# EAGLE design midi_IO_Thru (EAGLE 9.3.0)
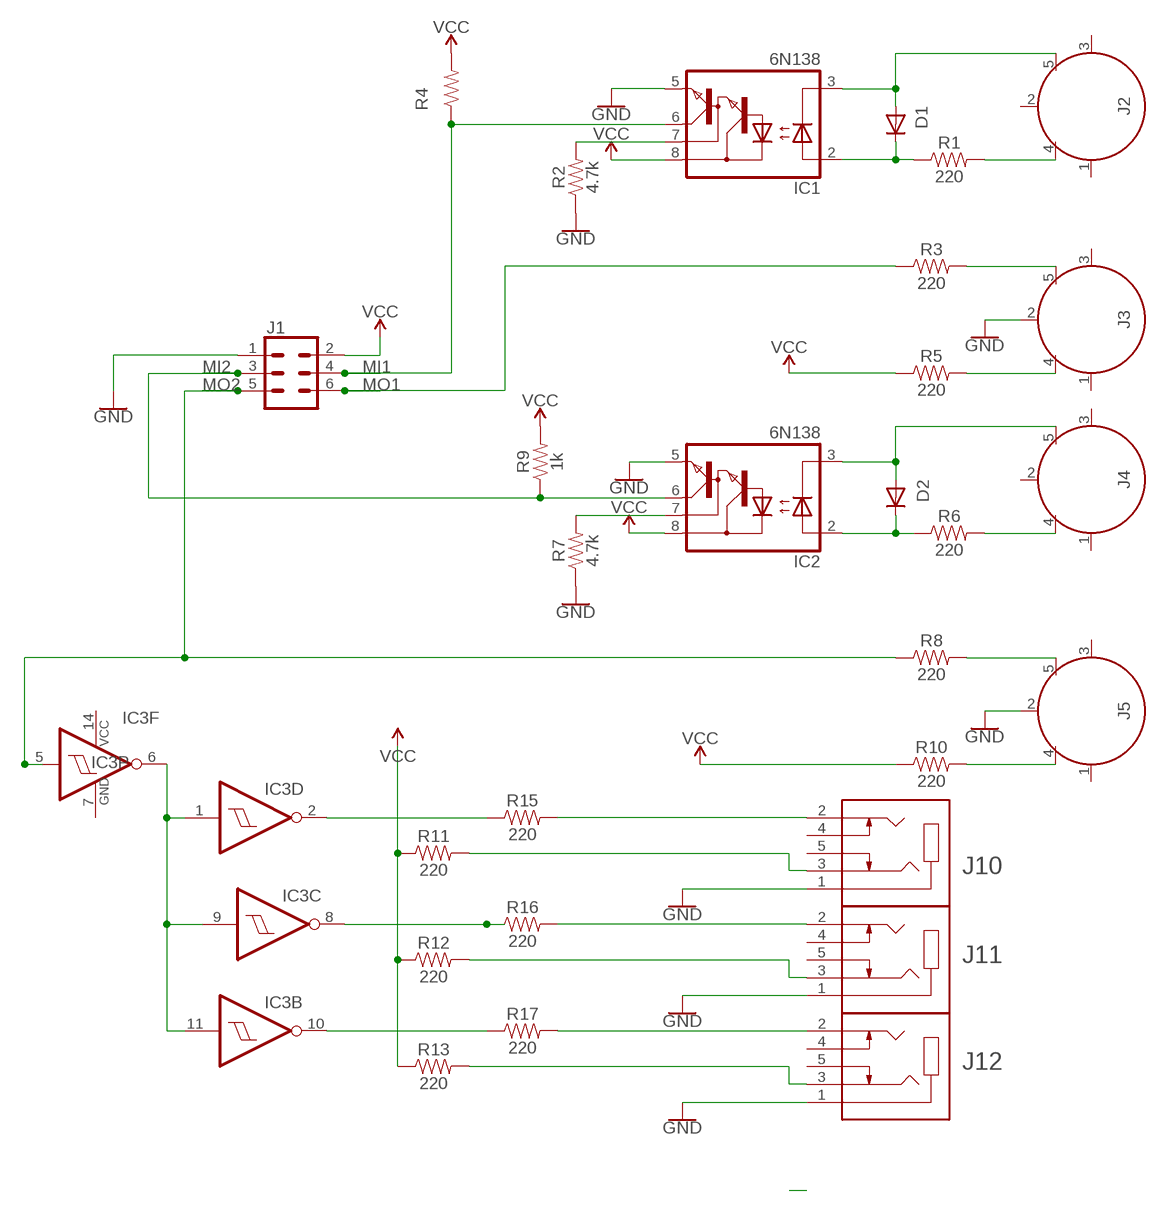
[diagram p0: schematic, sheet 1]

## Parts
D1  1N4148DO35-7  [DO35-7]
D2  1N4148DO35-7  [DO35-7]
IC1  6N138  [DIL08]
IC2  6N138  [DIL08]
IC3  74HC14D  [SO14]
J1  CONN_03X2SHROUD  [2X3-SHROUDED]
J2  DIN5  [DIN5-RA-PTH]
J3  DIN5  [DIN5-RA-PTH]
J4  DIN5  [DIN5-RA-PTH]
J5  DIN5  [DIN5-RA-PTH]
J10  SJ1-3535NG  [CUI_SJ1-3535NG]
J11  SJ1-3535NG  [CUI_SJ1-3535NG]
J12  SJ1-3535NG  [CUI_SJ1-3535NG]
R1  220  330OHM-HORIZ-1/10W-5%  [AXIAL-0.3]
R2  4.7k  330OHM-HORIZ-1/10W-5%  [AXIAL-0.3]
R3  220  330OHM-HORIZ-1/10W-5%  [AXIAL-0.3]
R4  1k  330OHM-HORIZ-1/10W-5%  [AXIAL-0.3]
R5  220  330OHM-HORIZ-1/10W-5%  [AXIAL-0.3]
R6  220  330OHM-HORIZ-1/10W-5%  [AXIAL-0.3]
R7  4.7k  330OHM-HORIZ-1/10W-5%  [AXIAL-0.3]
R8  220  330OHM-HORIZ-1/10W-5%  [AXIAL-0.3]
R9  1k  330OHM-HORIZ-1/10W-5%  [AXIAL-0.3]
R10  220  330OHM-HORIZ-1/10W-5%  [AXIAL-0.3]
R11  220  330OHM-HORIZ-1/10W-5%  [AXIAL-0.3]
R12  220  330OHM-HORIZ-1/10W-5%  [AXIAL-0.3]
R13  220  330OHM-HORIZ-1/10W-5%  [AXIAL-0.3]
R15  220  330OHM-HORIZ-1/10W-5%  [AXIAL-0.3]
R16  220  330OHM-HORIZ-1/10W-5%  [AXIAL-0.3]
R17  220  330OHM-HORIZ-1/10W-5%  [AXIAL-0.3]

## Nets
GND: IC1.5(GND) IC2.5(GND) J1.1 J3.2 J5.2 J10.1 J11.1 J12.1 R2.P$1 R7.P$1
MI1: IC1.6(VO) J1.4 R4.P$1
MI2: IC2.6(VO) J1.3 R9.P$1
MO1: J1.6 R3.P$1
MO2: IC3.5(F:I) J1.5 R8.P$1
N$1: IC3.1(D:I) IC3.6(F:O) IC3.9(C:I) IC3.11(B:I)
N$2: IC3.2(D:O) R15.P$1
N$3: IC3.8(C:O) R16.P$1
N$4: IC3.10(B:O) R17.P$1
N$5: J10.2 R15.P$2
N$6: J11.2 R16.P$2
N$7: J12.2 R17.P$2
N$8: D1.C IC1.2(A) R1.P$1
N$9: J10.3 R11.P$2
N$10: J11.3 R12.P$2
N$11: J12.3 R13.P$2
N$13: J5.4 R10.P$2
N$14: D2.A IC2.3(C) J4.5
N$15: D2.C IC2.2(A) R6.P$1
N$16: J4.4 R6.P$2
N$17: J2.4 R1.P$2
N$18: IC1.7(VB) R2.P$2
N$19: J3.5 R3.P$2
N$20: J3.4 R5.P$2
N$21: J5.5 R8.P$2
N$23: IC2.7(VB) R7.P$2
N$26: D1.A IC1.3(C) J2.5
VCC: IC1.8(VCC) IC2.8(VCC) J1.2 R4.P$2 R5.P$1 R9.P$2 R10.P$1 R11.P$1 R12.P$1 R13.P$1
Unconnected: IC3.3(E:I) IC3.4(E:O) IC3.12(A:O) IC3.13(A:I) J2.1 J2.2 J2.3 J3.1 J3.3 J4.1 J4.2 J4.3 J5.1 J5.3 J10.4 J10.5 J11.4 J11.5 J12.4 J12.5

## Power pins joined to a net without a drawn wire
GND: IC3.7(P:GND)
VCC: IC3.14(P:VCC)

## Library data of the parts
D1 D2 = diode:1N4148: DIODE high speed (Philips)
IC1 IC2 = optocoupler:6N138: MOTOROLA OPTO COUPLER; MF: VISHAY/TELEFUNKEN; MPN: 6N138; OC_FARNELL: 9860150; OC_NEWARK: 35K5294
IC3 = 74xx-eu:74*14: Hex schmitt trigger INVERTER
J1 = SparkFun-Connectors:CONN_03X2: Multi connection point. Often used as Generic Header-pin footprint for 0.1 inch spaced/style header connections You can populate with any combo of single row headers, but if you'd like an exact match, check these: Header - 2x3 (Male, 0.1") <https://www.sparkfun.com/products/12807> (PRT-12807) Header - 2x3 (Female, 0.1") <https://www.sparkfun.com/products/13010> (PRT-13010) 2x3 Pin Shrouded Header <https://www.sparkfun.com/products/10877> (PRT-10877) On any of the 0.1 inch spaced packages, you can populate with these: Break Away Headers - Straight <https://www.sparkfun.com/products/116> (PRT-00116) Break Away Male Headers - Right Angle <https://www.sparkfun.com/products/553> (PRT-00553) Female Headers <https://www.sparkfun.com/products/115> (PRT-00115) Break Away Headers - Machine Pin <https://www.sparkfun.com/products/117> (PRT-00117) Break Away Female Headers - Swiss Machine Pin <https://www.sparkfun.com/products/743> (PRT-00743) Special note: the shrouded connector mates well with our 3x2 ribbon cables: Ribbon Crimp Connector - 6-pin (2x3, Female) <https://www.sparkfun.com/products/10651> (PRT-10651) Ribbon Cable - 6 wire (15ft) <https://www.sparkfun.com/products/10646> (PRT-10646); PROD_ID: CONN-10681; SF_ID: PRT_10877
J2-J5 = SparkFun-Connectors:DIN5: DIN5 Connector - Female Right Angle (frequently used as a MIDI Jack connector) This type of connector and cable is frequently used for transmitting midi data (musical instrument digital interface). It is what you usually see on a keyboard or set of electronic drums. Learn more here <https://en.wikipedia.org/wiki/MIDI>. For more information on the pinout and electrical specifications of MIDI communications, please see the following resource: https://www.midi.org/specifications/item/midi-din-electrical-specification Here is the connector we sell at SparkFun: MIDI Connector - Female Right Angle <https://www.sparkfun.com/products/9536> (PRT-09536) Datasheet <hhttp://www.sparkfun.com/datasheets/Prototyping/Connectors/MIDI-RA.pdf> It is used on this SparkFun product: SparkFun MIDI Shield <https://www.sparkfun.com/products/12898> (DEV-12898); PROD_ID: CONN-09481
J10-J12 = SJ1-3535NG:SJ1-3535NG: SJ1 Series 3.5 mm 12 V Right Angle Through Hole Isolated Stereo Audio Jack; AVAILABILITY: Unavailable; CUI_PURCHASE_URL: https://www.cui.com/product/interconnect/audio-connectors/3.5-mm-jacks/sj1-353xng-series?utm_source=snapeda.com&utm_medium=referral&utm_campaign=snapedaBOM; DESCRIPTION: SJ1 Series 3.5 mm 12 V Right Angle Through Hole Isolated Stereo Audio Jack; MF: CUI Inc.; MP: SJ1-3535NG; PACKAGE: None; PRICE: None
R1-R13 R15-R17 = SparkFun-Resistors:330OHM: 330Ω resistor A resistor is a passive two-terminal electrical component that implements electrical resistance as a circuit element. Resistors act to reduce current flow, and, at the same time, act to lower voltage levels within circuits. - Wikipedia; PROD_ID: RES-8371; VALUE: 330

## Net classes
0 default: width 0.508 mm, drill 1.016 mm, clearance 0.508 mm

## Board
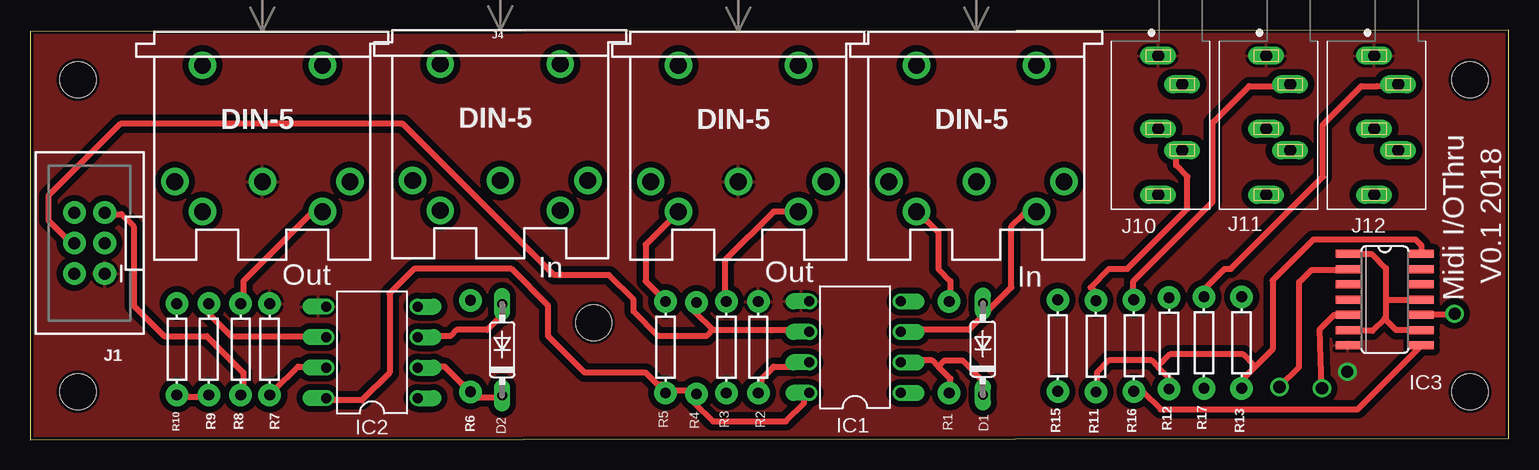
[diagram p1: board, top side]
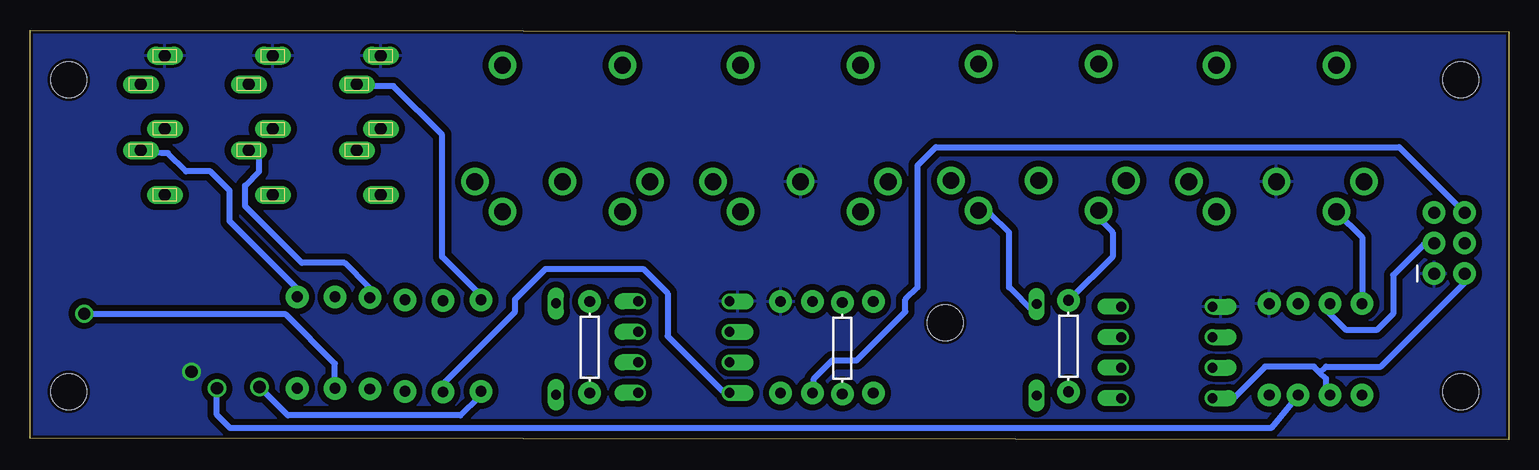
[diagram p2: board, bottom side, seen from below]

Size 123.24 x 34.14 mm. Coordinates in mm from the lower left corner, seen from the top.
Outline: 0,0 123.24,0.14 123.24,34.14 0,34 0,0
Copper layers (1*16): Top 0.035mm / dielectric 1.5mm / Bottom 0.035mm
Design rules "dirt_cheap_dirty_boards.v1.1": minimum track width 6mil, minimum drill 12mil, track to track 6mil, track to pad 6mil, pad to pad 6mil, via to via 6mil, smd to smd 0mil, copper to edge 10mil, drill to drill 10mil, minimum pad ring 10mil, minimum via ring 6mil, stop-mask expansion 2mil, vias tented up to drill 25mil, thermal gap 10mil
Holes 3 mm at 4,30 4,4 120,30 120,4 46.98,9.74

### Footprints (pad centres in the part's own frame; a part is rotated, then mirrored left to right if it is on the bottom)
DO35-7 = drill 0.813 long: A 3.81,0; C -3.81,0
DIL08 = drill 0.813 offset: 1 -3.81,-3.81; 2 -1.27,-3.81; 3 1.27,-3.81; 4 3.81,-3.81; 5 3.81,3.81; 6 1.27,3.81; 7 -1.27,3.81; 8 -3.81,3.81
SO14 = smd 0.66 x 2.032: 1 -3.81,-3.073; 2 -2.54,-3.073; 3 -1.27,-3.073; 4 0,-3.073; 5 1.27,-3.073; 6 2.54,-3.073; 7 3.81,-3.073; 8 3.81,3.073; 9 2.54,3.073; 10 1.27,3.073; 11 0,3.073; 12 -1.27,3.073; 13 -2.54,3.073; 14 -3.81,3.073
2X3-SHROUDED = drill 1.016 pad 1.88: 1 -1.27,2.54; 2 1.27,2.54; 3 -1.27,0; 4 1.27,0; 5 -1.27,-2.54; 6 1.27,-2.54
DIN5-RA-PTH = drill 1.4 pad 2.286: 1 7.3,12.5; 2 0,12.5; 3 -7.3,12.5; 4 5,15; 5 -5,15; 6 -5,2.8; 7 5,2.8
CUI_SJ1-3535NG = drill 1 long: 1 0,0; 2 2.4,2; 3 7.9,2; 4 11.6,0; 5 6.1,0
AXIAL-0.3 = drill 0.9 pad 1.88: P$1 -3.81,0; P$2 3.81,0

### Placement (x,y rotation side)
D1  79.41,7.55 90 top
D2  39.35,7.49 90 top
IC1  68.75,7.72 90 top
IC2  28.5,7.27 90 top
IC3  112.9,11.67 270 top
J1  4.96,16.38 180 top
J2  78.87,34 180 top
J3  59.03,34 180 top
J4  39.19,34.1 180 top
J5  19.37,34 180 top
J10  94,32 270 top
J11  103,32 270 top
J12  112,32 270 top
R1  76.6,7.7 90 bottom
R2  60.69,7.7 270 top
R3  58.03,7.7 90 top
R4  55.55,7.62 270 bottom
R5  52.96,7.7 90 top
R6  36.7,7.8 90 bottom
R7  19.97,7.53 270 top
R8  17.56,7.53 90 top
R9  14.9,7.53 270 top
R10  12.24,7.53 90 top
R11  88.83,7.78 90 top
R12  94.92,8.03 90 top
R13  100.97,8.09 90 top
R15  85.65,7.84 90 top
R16  91.99,7.84 90 top
R17  97.83,8.09 90 top

### Tracks (layer width: path | path; a pad name or v marks a point on that pad's centre or on a via)
GND  (via drill 1.02)
  other vias: 109.78,5.66
  pour Top: -2,36 134,36 134,-2 -2,-2
  pour Bottom: -2,36 134,36 134,-2 -2,-2
MI1
  Top 0.508: 56.9,9.14 61.87,9.14 61.84,9.11 61.8,9.14 64.52,9.14 IC1.6 | 56.9,9.14 55.37,10.67 55.37,11.18 R4.P$1 | 56.9,9.14 56.39,8.64 52.32,8.64 50.29,10.67 50.29,11.68 48.26,13.72 43.69,13.72 31.08,26.32 7.53,26.32 1.52,20.32 1.52,18.29 3.05,16.76 3.56,16.76 J1.4
MI2
  Top 0.508: IC2.6 24.38,8.64 16.76,8.64 14.73,10.67 14.73,11.18 R9.P$1
  Bottom 0.508: J1.3 6.6,16.26 7.11,16.26 9.65,13.72 9.65,10.49 11.02,9.12 13.54,9.12 15.04,10.62 15.04,11.48 R9.P$1
MO1
  Bottom 0.508: J1.6 4.06,19.3 9.14,24.38 47.75,24.38 49.28,22.86 49.28,12.7 50.29,11.68 50.29,10.67 54.36,6.6 56.39,6.6 57.91,5.08 57.91,4.06 R3.P$1
MO2  (via drill 1.02)
  Top 0.508: R8.P$1 17.78,4.06 17.78,5.59 14.73,8.64 11.18,8.64 8.64,11.18 8.64,17.78 7.62,18.8 7.11,18.8 6.6,18.29 6.1,18.29 6.1,18.8 J1.5 | v107.66,4.28 107.48,9.21 108.67,10.4 IC3.5
  Bottom 0.508: R8.P$1 19.82,0.96 106.56,0.96 107.66,2.06 v107.66,4.28
N$1
  Top 0.508: IC3.6 109.85,9.08 109.87,9.06 111.86,9.06 112.89,10.09 | IC3.1 111.8,15.48 112.98,14.3 112.98,11.66 | 112.98,11.66 112.98,10.18 112.89,10.09 | IC3.11 115.94,11.64 115.94,11.62 113.02,11.62 112.98,11.66 | IC3.9 113.85,9.13 112.89,10.09
N$2  (via drill 1.02)
  Top 0.508: IC3.2 109.34,14.16 106.8,14.16 105.76,13.12 105.76,6.04 v104.12,4.4
  Bottom 0.508: v104.12,4.4 101.76,2.03 87.38,2.03 85.85,3.56 R15.P$1
N$3
  Top 0.508: R16.P$1 92.7,4.03 94.22,2.52 110.63,2.52 IC3.8
N$4  (via drill 1.02)
  Top 0.508: v118.72,10.5 118.62,10.4 IC3.10
  Bottom 0.508: R17.P$1 97.83,6.35 101.92,10.44 118.66,10.44 v118.72,10.5
N$5
  Bottom 0.508: J10.2 95.5,29.46 92.96,29.46 88.9,25.4 88.9,15.24 85.34,11.68 R15.P$2
N$6
  Top 0.508: J11.2 103.63,29.46 101.6,29.46 98.55,26.42 98.55,19.81 91.95,13.21 91.95,11.68 R16.P$2
N$7
  Top 0.508: J12.2 112.27,29.46 110.95,29.46 107.75,26.26 107.75,21.9 100.08,14.22 99.57,14.22 97.54,12.19 R17.P$2
N$8
  Top 0.508: 75.69,6.1 76.71,5.08 76.71,4.06 R1.P$1 | 75.69,6.1 75.18,6.6 72.64,6.6 IC1.2 | 75.69,6.1 76.2,6.6 77.72,6.6 79.25,5.08 79.25,4.06 D1.C
N$9
  Top 0.508: J10.3 95.5,23.88 95.5,22.86 96.45,21.92 96.45,19.23 91.44,14.22 89.92,14.22 88.39,12.7 88.9,12.19 88.9,11.68 R11.P$2
N$10
  Bottom 0.508: J11.3 104.14,23.88 104.14,22.35 105.32,21.18 105.32,19.46 100.58,14.73 97.03,14.73 95,12.7 95.5,12.19 95,11.68 R12.P$2
N$11
  Bottom 0.508: J12.3 112.27,23.88 111.76,23.88 110.24,22.35 108.2,22.35 106.61,20.76 106.61,18.22 101.09,12.7 101.6,12.19 101.6,11.68 101.09,11.68 R13.P$2
N$13
  Bottom 0.508: J5.4 12.24,16.87 R10.P$2
N$14
  Top 0.508: IC2.3 32.51,8.64 35.05,8.64 35.56,9.14 38.1,9.14 39.12,10.16 39.12,11.18 D2.A
  Bottom 0.508: J4.5 43.69,18.8 43.18,18.8 41.66,17.27 41.66,12.7 39.62,10.67 39.12,11.18 D2.A
N$15
  Top 0.508: IC2.2 32.51,6.1 34.54,6.1 36.07,4.57 36.58,4.57 37.08,4.06 R6.P$1 37.08,3.56 39.12,3.56 D2.C
N$16
  Bottom 0.508: R6.P$2 36.58,11.68 33.02,15.24 33.02,17.27 34.54,18.8 J4.4
N$17
  Top 0.508: R1.P$2 76.71,11.68 76.71,13.21 75.69,14.22 75.69,17.27 74.68,18.29 74.17,18.29 73.66,18.8 J2.4
N$18
  Top 0.508: IC1.7 64.52,6.1 61.98,6.1 60.96,5.08 60.96,4.06 R2.P$2
N$19
  Top 0.508: J3.5 61.97,19 57.91,14.94 57.91,11.68 R3.P$2
N$20
  Top 0.508: R5.P$2 52.83,11.68 51.31,13.21 51.31,16.26 53.34,18.29 53.34,18.8 53.85,19.3 J3.4
N$21
  Top 0.508: R8.P$2 17.78,11.68 17.78,13.21 23.37,18.8 23.88,18.29 24.38,18.8 J5.5
N$23
  Top 0.508: IC2.7 24.38,6.1 22.35,6.1 20.32,4.06 R7.P$2
N$26
  Top 0.508: 79.25,10.16 78.23,9.14 72.64,9.14 IC1.3 | 79.25,10.16 79.25,11.18 D1.A 79.25,10.16 | 79.25,10.16 81.79,12.7 81.79,17.78 82.8,18.8 83.82,18.8 J2.5
VCC
  Top 0.508: R10.P$1 12.7,3.56 14.73,3.56 R9.P$2 | IC1.8 64.52,3.56 64.52,3.05 62.99,1.52 56.9,1.52 55.37,3.05 55.37,3.56 R4.P$2 55.37,4.06 53.34,4.06 | 93.98,6.1 95.5,4.57 95,4.06 R12.P$1 | 93.98,6.1 93.47,6.6 89.92,6.6 88.9,5.59 88.9,4.06 R11.P$1 | 102.11,6.1 103.54,7.53 103.54,13.28 106.94,16.68 115.46,16.68 115.97,16.17 IC3.14 | 102.11,6.1 101.09,5.08 101.09,4.57 R13.P$1 | 93.98,6.1 95,7.11 101.09,7.11 102.11,6.1 | 53.34,4.06 52.83,4.57 52.32,4.57 51.31,5.59 46.23,5.59 43.18,8.64 43.18,11.18 40.13,14.22 32,14.22 29.97,12.19 29.97,5.59 27.66,3.27 24.78,3.27 IC2.8 | 53.34,4.06 R5.P$1
  Bottom 0.508: 15.75,5.59 15.24,5.08 15.24,4.06 R9.P$2 | 15.75,5.59 16.26,6.1 20.32,6.1 22.86,3.56 24.38,3.56 IC2.8 | 15.75,5.59 15.24,6.1 10.67,6.1 3.56,13.21 3.56,13.72 J1.2 | IC1.8 65.02,4.06 65.53,4.06 70.1,8.64 70.1,12.19 72.14,14.22 80.26,14.22 82.8,11.68 82.8,10.67 88.9,4.57 88.9,4.06 R11.P$1

### Text on the board
tPlace: Midi I/OThru | V0.1 2018 | In | Out | Out | In